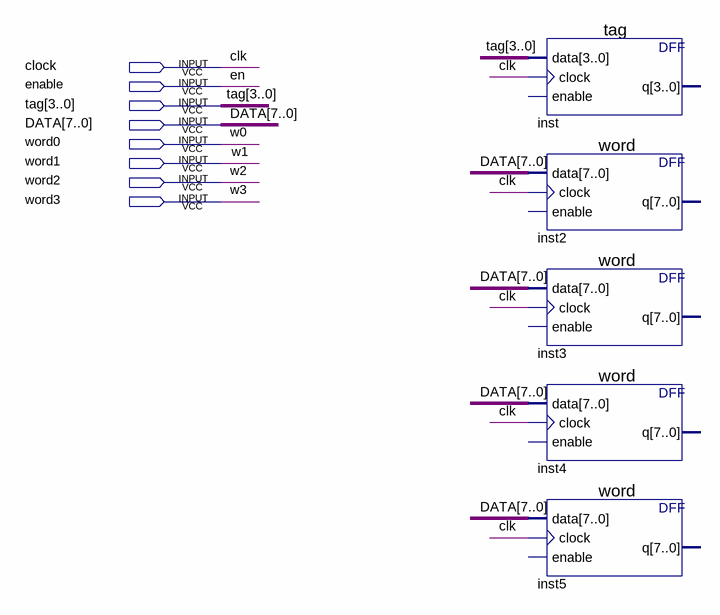
[diagram p0: schematic sheet]
// Quartus schematic c_line.bdf as structural Verilog: 5 symbols, 8 pins
module c_line (
  input  clock,
  input  enable,
  input  [3:0] tag,
  input  [7:0] DATA,
  input  word0,
  input  word1,
  input  word2,
  input  word3
);

  tag inst (.data(tag), .clock(clock));  // open: enable, q
  word inst2 (.data(DATA), .clock(clock));  // open: enable, q
  word inst3 (.data(DATA), .clock(clock));  // open: enable, q
  word inst4 (.data(DATA), .clock(clock));  // open: enable, q
  word inst5 (.data(DATA), .clock(clock));  // open: enable, q

  // Other names for the same wires on the sheet: clk = clock; en = enable; w0 = word0; w1 = word1; w2 = word2;
  //   w3 = word3
endmodule
